# EAGLE design LedCubeControl (EAGLE 9.6.2)
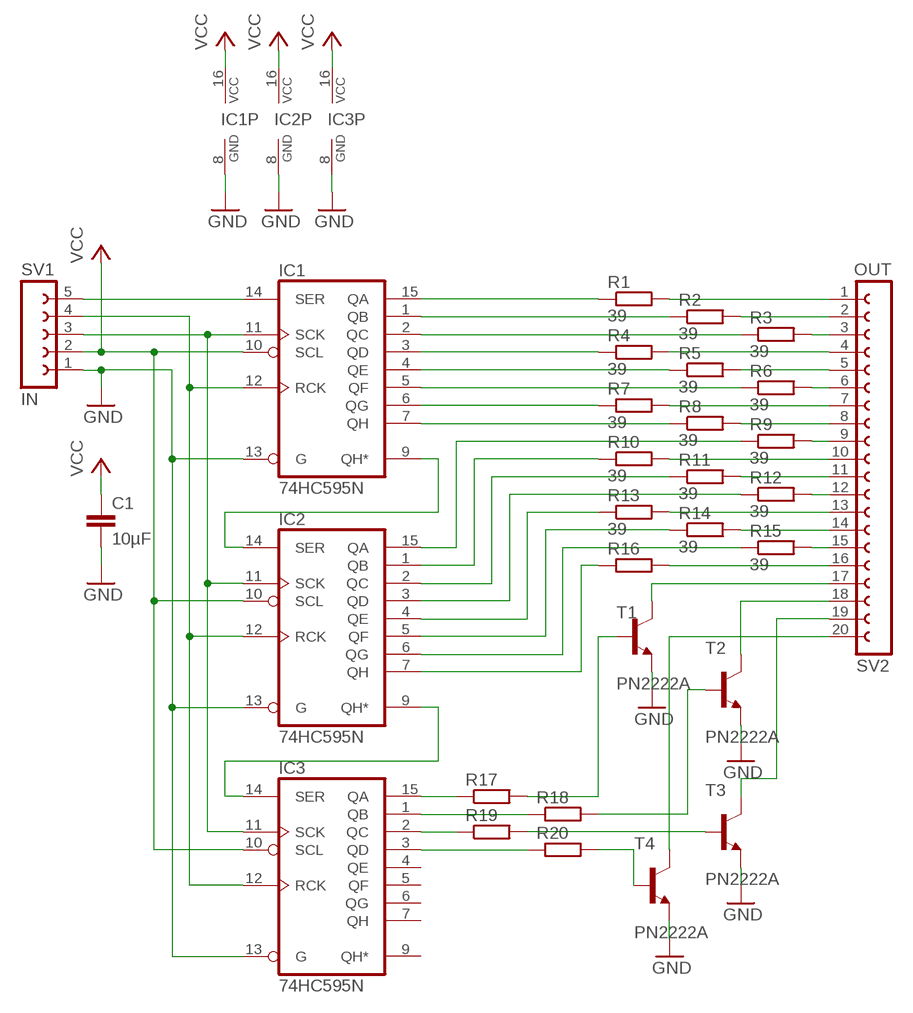
[diagram p0: schematic, sheet 1]

## Parts
C1  10µF  C-EU050-024X044  [C050-024X044]
IC1  74HC595N  [DIL16]
IC2  74HC595N  [DIL16]
IC3  74HC595N  [DIL16]
R1  39  R-EU_0207/10  [0207/10]
R2  39  R-EU_0207/10  [0207/10]
R3  39  R-EU_0207/10  [0207/10]
R4  39  R-EU_0207/10  [0207/10]
R5  39  R-EU_0207/10  [0207/10]
R6  39  R-EU_0207/10  [0207/10]
R7  39  R-EU_0207/10  [0207/10]
R8  39  R-EU_0207/10  [0207/10]
R9  39  R-EU_0207/10  [0207/10]
R10  39  R-EU_0207/10  [0207/10]
R11  39  R-EU_0207/10  [0207/10]
R12  39  R-EU_0207/10  [0207/10]
R13  39  R-EU_0207/10  [0207/10]
R14  39  R-EU_0207/10  [0207/10]
R15  39  R-EU_0207/10  [0207/10]
R16  39  R-EU_0207/10  [0207/10]
R17  1k  R-EU_0207/10  [0207/10]
R18  1k  R-EU_0207/10  [0207/10]
R19  1k  R-EU_0207/10  [0207/10]
R20  1k  R-EU_0207/10  [0207/10]
SV1  IN  FE05-1  [FE05-1]
SV2  OUT  FE20-1  [FE20]
T1  PN2222A  BC317-NPN-TO92-EBC  [TO92-EBC]
T2  PN2222A  BC317-NPN-TO92-EBC  [TO92-EBC]
T3  PN2222A  BC317-NPN-TO92-EBC  [TO92-EBC]
T4  PN2222A  BC317-NPN-TO92-EBC  [TO92-EBC]

## Nets
GND: C1.2 IC1.8(GND) IC1.13(G) IC2.8(GND) IC2.13(G) IC3.8(GND) IC3.13(G) SV1.1 T1.E T2.E T3.E T4.E
N$1: IC1.11(SCK) IC2.11(SCK) IC3.11(SCK) SV1.3
N$2: IC1.9(QH*) IC2.14(SER)
N$3: IC1.12(RCK) IC2.12(RCK) IC3.12(RCK) SV1.4
N$4: R1.2 SV2.1
N$5: R2.2 SV2.2
N$6: R3.2 SV2.3
N$7: R6.2 SV2.6
N$8: R9.2 SV2.9
N$9: R12.2 SV2.12
N$10: R15.2 SV2.15
N$11: IC2.7(QH) R16.1
N$12: IC2.6(QG) R15.1
N$13: IC2.5(QF) R14.1
N$14: IC2.4(QE) R13.1
N$15: R16.2 SV2.16
N$16: R14.2 SV2.14
N$17: R13.2 SV2.13
N$18: R11.2 SV2.11
N$19: R10.2 SV2.10
N$20: R8.2 SV2.8
N$21: R7.2 SV2.7
N$22: R5.2 SV2.5
N$23: R4.2 SV2.4
N$24: IC1.15(QA) R1.1
N$25: IC1.1(QB) R2.1
N$26: IC1.3(QD) R4.1
N$27: IC1.2(QC) R3.1
N$28: IC1.4(QE) R5.1
N$29: IC1.5(QF) R6.1
N$30: IC1.6(QG) R7.1
N$31: IC1.7(QH) R8.1
N$32: IC2.3(QD) R12.1
N$33: IC2.2(QC) R11.1
N$34: IC2.1(QB) R10.1
N$35: IC2.15(QA) R9.1
N$36: IC3.15(QA) R17.1
N$37: R17.2 T1.B
N$38: SV2.17 T1.C
N$39: IC3.1(QB) R18.1
N$40: R18.2 T2.B
N$41: SV2.18 T2.C
N$42: IC3.2(QC) R19.1
N$43: SV2.19 T3.C
N$44: R19.2 T3.B
N$45: IC3.3(QD) R20.1
N$46: SV2.20 T4.C
N$47: R20.2 T4.B
N$48: IC1.14(SER) SV1.5
N$49: IC2.9(QH*) IC3.14(SER)
VCC: C1.1 IC1.10(SCL) IC1.16(VCC) IC2.10(SCL) IC2.16(VCC) IC3.10(SCL) IC3.16(VCC) SV1.2
Unconnected: IC3.4(QE) IC3.5(QF) IC3.6(QG) IC3.7(QH) IC3.9(QH*)

## Library data of the parts
C1 = rcl:C-EU: CAPACITOR, European symbol; SPICEPREFIX: C
IC1-IC3 = 74xx-eu:74*595: 8-bit SHIFT REGISTER, output latch
R1-R20 = rcl:R-EU_: RESISTOR, European symbol; SPICEPREFIX: R
SV1 = con-lsta:FE05-1: FEMALE HEADER; OC_FARNELL: unknown; OC_NEWARK: unknown
SV2 = con-lsta:FE20-1: FEMALE HEADER; OC_FARNELL: unknown; OC_NEWARK: unknown
T1-T4 = transistor:*-NPN-: NPN Transistror BF959 corrected 2008.03.06

## Board
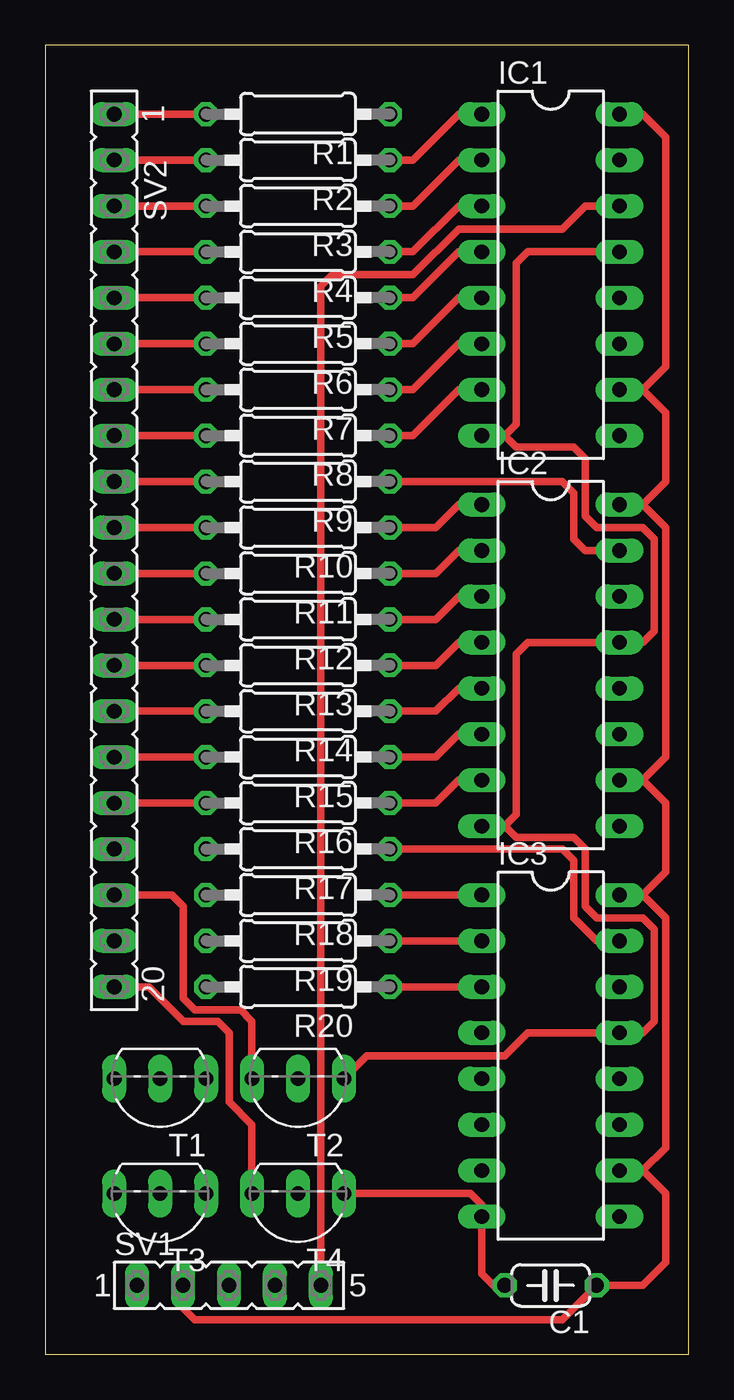
[diagram p1: board, top side]
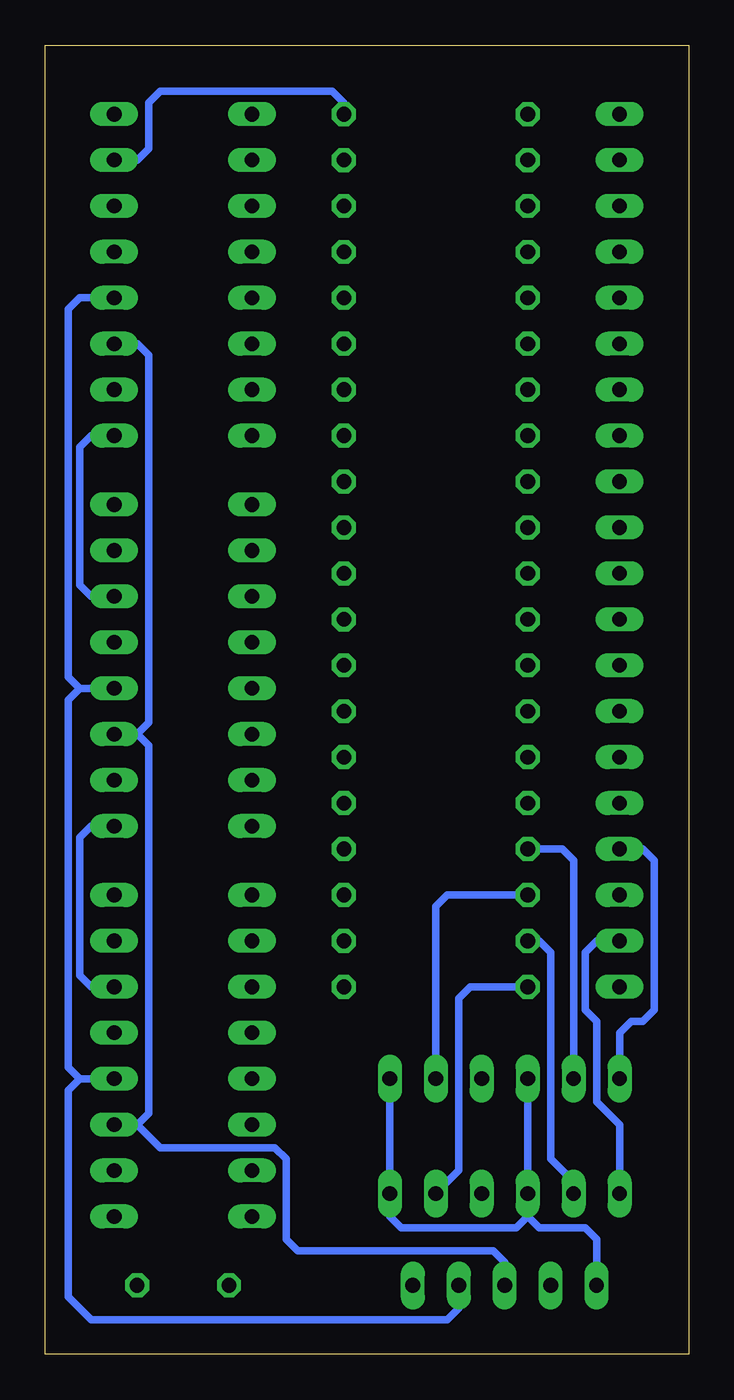
[diagram p2: board, bottom side, seen from below]

Size 35.56 x 72.39 mm. Coordinates in mm from the lower left corner, seen from the top.
Outline: 0,0 35.56,0 35.56,72.39 0,72.39 0,0
Copper layers (1*16): Top 0.035mm / dielectric 1.5mm / Bottom 0.035mm
Design rules "default *": minimum track width 16mil, minimum drill 0.5mm, track to track 6mil, track to pad 6mil, pad to pad 6mil, via to via 6mil, smd to smd 6mil, copper to edge 40mil, drill to drill 6mil, minimum pad ring 10mil, minimum via ring 8mil, stop-mask expansion 4mil, vias tented up to drill 0mil, thermal gap 10mil

### Footprints (pad centres in the part's own frame; a part is rotated, then mirrored left to right if it is on the bottom)
C050-024X044 = drill 0.813 octagon: 1 -2.54,0; 2 2.54,0
DIL16 = drill 0.813 long: 1 -8.89,-3.81; 2 -6.35,-3.81; 3 -3.81,-3.81; 4 -1.27,-3.81; 5 1.27,-3.81; 6 3.81,-3.81; 7 6.35,-3.81; 8 8.89,-3.81; 9 8.89,3.81; 10 6.35,3.81; 11 3.81,3.81; 12 1.27,3.81; 13 -1.27,3.81; 14 -3.81,3.81; 15 -6.35,3.81; 16 -8.89,3.81
0207/10 = drill 0.813 octagon: 1 -5.08,0; 2 5.08,0
FE05-1 = drill 0.813 long: 1 -5.08,0; 2 -2.54,0; 3 0,0; 4 2.54,0; 5 5.08,0
FE20 = drill 0.813 long: 1 -24.13,0; 2 -21.59,0; 3 -19.05,0; 4 -16.51,0; 5 -13.97,0; 6 -11.43,0; 7 -8.89,0; 8 -6.35,0; 9 -3.81,0; 10 -1.27,0; 11 1.27,0; 12 3.81,0; 13 6.35,0; 14 8.89,0; 15 11.43,0; 16 13.97,0; 17 16.51,0; 18 19.05,0; 19 21.59,0; 20 24.13,0
TO92-EBC = drill 0.813 long: B 0,-1.27; C 2.54,-1.27; E -2.54,-1.27

### Placement (x,y rotation side)
C1  27.94,3.81 180 top
IC1  27.94,59.69 270 top
IC2  27.94,38.1 270 top
IC3  27.94,16.51 270 top
R1  13.97,68.58 180 top
R2  13.97,66.04 180 top
R3  13.97,63.5 180 top
R4  13.97,60.96 180 top
R5  13.97,58.42 180 top
R6  13.97,55.88 180 top
R7  13.97,53.34 180 top
R8  13.97,50.8 180 top
R9  13.97,48.26 180 top
R10  13.97,45.72 180 top
R11  13.97,43.18 180 top
R12  13.97,40.64 180 top
R13  13.97,38.1 180 top
R14  13.97,35.56 180 top
R15  13.97,33.02 180 top
R16  13.97,30.48 180 top
R17  13.97,27.94 180 top
R18  13.97,25.4 180 top
R19  13.97,22.86 180 top
R20  13.97,20.32 180 top
SV1  10.16,3.81 0 top
SV2  3.81,44.45 270 top
T1  6.35,13.97 180 top
T2  13.97,13.97 180 top
T3  6.35,7.62 180 top
T4  13.97,7.62 180 top

### Tracks (layer width: path | path; a pad name or v marks a point on that pad's centre or on a via)
GND
  Top 0.406: C1.2 24.77,3.81 24.13,4.45 IC3.8 24.13,8.26 23.5,8.89 T4.E | 25.4,50.8 26.04,51.44 26.04,60.33 26.67,60.96 IC1.13 | 25.4,50.8 IC1.8 | 25.4,50.8 26.04,50.16 29.21,50.16 29.84,49.53 29.84,46.35 30.48,45.72 33.02,45.72 33.66,45.09 33.66,40.01 33.02,39.37 IC2.13 26.67,39.37 26.04,38.73 26.04,29.84 25.4,29.21 | 25.4,29.21 26.04,28.57 29.21,28.57 29.84,27.94 29.84,24.77 30.48,24.13 33.02,24.13 33.66,23.5 33.66,18.41 33.02,17.78 IC3.13 26.67,17.78 25.4,16.51 17.78,16.51 T2.E | 25.4,29.21 IC2.8
  Bottom 0.406: T1.E T3.E 8.89,7.62 | T2.E T4.E 16.51,7.62 15.88,6.99 9.53,6.99 8.89,7.62 | 8.89,7.62 8.26,6.99 5.71,6.99 5.08,6.35 SV1.1
N$1
  Bottom 0.406: IC1.11 30.48,55.88 29.84,55.24 29.84,34.92 30.48,34.29 | 30.48,34.29 IC2.11 | IC3.11 30.48,12.7 | 30.48,12.7 29.84,13.34 29.84,33.66 30.48,34.29 | SV1.3 10.16,5.08 10.79,5.71 21.59,5.71 22.23,6.35 22.23,10.79 22.86,11.43 29.21,11.43 30.48,12.7
N$2
  Bottom 0.406: IC1.9 33.02,50.8 33.66,50.16 33.66,42.55 33.02,41.91 IC2.14
N$3
  Bottom 0.406: IC1.12 33.66,58.42 34.29,57.78 34.29,37.47 33.66,36.83 | 33.66,15.24 34.29,15.88 34.29,36.2 33.66,36.83 | 33.66,15.24 IC3.12 | 33.66,36.83 IC2.12 | SV1.4 12.7,2.54 13.34,1.91 33.02,1.91 34.29,3.17 34.29,14.61 33.66,15.24
N$4
  Top 0.406: SV2.1 R1.2
N$5
  Top 0.406: R2.2 SV2.2
N$6
  Top 0.406: SV2.3 R3.2
N$7
  Top 0.406: SV2.6 R6.2
N$8
  Top 0.406: R9.2 SV2.9
N$9
  Top 0.406: R12.2 SV2.12
N$10
  Top 0.406: SV2.15 R15.2
N$11
  Top 0.406: R16.1 21.59,30.48 22.86,31.75 IC2.7
N$12
  Top 0.406: IC2.6 22.86,34.29 21.59,33.02 R15.1
N$13
  Top 0.406: R14.1 21.59,35.56 22.86,36.83 IC2.5
N$14
  Top 0.406: IC2.4 22.86,39.37 21.59,38.1 R13.1
N$15
  Top 0.406: R16.2 SV2.16
N$16
  Top 0.406: R14.2 SV2.14
N$17
  Top 0.406: SV2.13 R13.2
N$18
  Top 0.406: SV2.11 R11.2
N$19
  Top 0.406: SV2.10 R10.2
N$20
  Top 0.406: SV2.8 R8.2
N$21
  Top 0.406: R7.2 SV2.7
N$22
  Top 0.406: SV2.5 R5.2
N$23
  Top 0.406: R4.2 SV2.4
N$24
  Bottom 0.406: IC1.15 30.48,66.04 29.84,66.67 29.84,69.22 29.21,69.85 19.68,69.85 19.05,69.22 R1.1
N$25
  Top 0.406: IC1.1 22.86,68.58 20.32,66.04 R2.1
N$26
  Top 0.406: R4.1 20.32,60.96 22.86,63.5 IC1.3
N$27
  Top 0.406: IC1.2 22.86,66.04 20.32,63.5 R3.1
N$28
  Top 0.406: IC1.4 22.86,60.96 20.32,58.42 R5.1
N$29
  Top 0.406: R6.1 20.32,55.88 22.86,58.42 IC1.5
N$30
  Top 0.406: IC1.6 22.86,55.88 20.32,53.34 R7.1
N$31
  Top 0.406: R8.1 20.32,50.8 22.86,53.34 IC1.7
N$32
  Top 0.406: IC2.3 22.86,41.91 21.59,40.64 R12.1
N$33
  Top 0.406: IC2.2 22.86,44.45 21.59,43.18 R11.1
N$34
  Top 0.406: IC2.1 22.86,46.99 21.59,45.72 R10.1
N$35
  Top 0.406: IC2.15 29.84,44.45 29.21,45.09 29.21,47.62 28.57,48.26 R9.1
N$36
  Top 0.406: IC3.15 30.48,22.86 29.21,24.13 29.21,27.3 28.57,27.94 R17.1
N$37
  Bottom 0.406: T1.B 6.35,27.3 6.99,27.94 R17.2
N$38
  Bottom 0.406: SV2.17 2.54,27.94 1.91,27.3 1.91,19.05 2.54,18.41 3.17,18.41 3.81,17.78 T1.C
N$39
  Top 0.406: R18.1 IC3.1
N$40
  Bottom 0.406: T2.B 13.97,24.77 13.34,25.4 R18.2
N$41
  Top 0.406: T2.C 11.43,18.41 10.79,19.05 8.26,19.05 7.62,19.68 7.62,24.77 6.99,25.4 SV2.18
N$42
  Top 0.406: IC3.2 R19.1
N$43
  Bottom 0.406: T3.C 3.81,12.7 5.08,13.97 5.08,18.41 5.71,19.05 5.71,22.23 5.08,22.86 SV2.19
N$44
  Bottom 0.406: R19.2 8.26,22.86 7.62,22.23 7.62,10.79 6.35,9.53 T3.B
N$45
  Top 0.406: R20.1 IC3.3
N$46
  Top 0.406: T4.C 11.43,12.7 10.16,13.97 10.16,17.78 9.53,18.41 7.62,18.41 5.71,20.32 SV2.20
N$47
  Bottom 0.406: R20.2 12.06,20.32 12.7,19.68 12.7,10.16 T4.B
N$48
  Top 0.406: SV1.5 15.24,59.05 15.88,59.69 20.32,59.69 22.86,62.23 28.57,62.23 29.84,63.5 IC1.14
N$49
  Bottom 0.406: IC2.9 33.02,29.21 33.66,28.57 33.66,20.95 33.02,20.32 IC3.14
VCC
  Top 0.406: 33.02,46.99 34.29,48.26 34.29,52.07 33.02,53.34 | IC1.10 33.02,53.34 | 33.02,53.34 34.29,54.61 34.29,67.31 33.02,68.58 IC1.16 | IC2.16 33.02,46.99 | 33.02,46.99 34.29,45.72 34.29,33.02 33.02,31.75 | IC2.10 33.02,31.75 | 33.02,31.75 34.29,30.48 34.29,26.67 33.02,25.4 | IC3.16 33.02,25.4 | 33.02,25.4 34.29,24.13 34.29,11.43 33.02,10.16 | IC3.10 33.02,10.16 | 33.02,10.16 34.29,8.89 34.29,5.08 33.02,3.81 C1.1 28.57,1.91 8.26,1.91 7.62,2.54 SV1.2